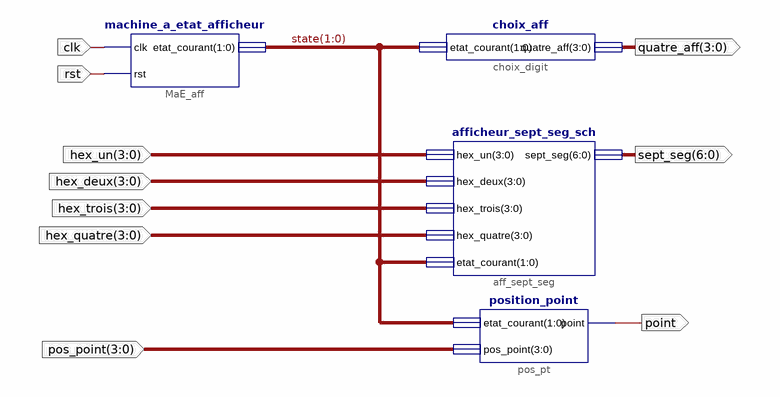
[diagram p0: schematic sheet 1]
// Xilinx ISE schematic afficheur_sch.sch (spartan3e) as structural Verilog: 4 symbols, 10 ports
module afficheur_sch (
  input  clk,
  input  rst,
  input  [3:0] hex_un,
  input  [3:0] hex_deux,
  input  [3:0] hex_trois,
  input  [3:0] hex_quatre,
  input  [3:0] pos_point,
  output [3:0] quatre_aff,
  output [6:0] sept_seg,
  output point
);

  wire [1:0] state;

  afficheur_sept_seg_sch aff_sept_seg (
    .hex_un(hex_un), .hex_deux(hex_deux), .hex_trois(hex_trois), .hex_quatre(hex_quatre),
    .etat_courant(state), .sept_seg(sept_seg));
  machine_a_etat_afficheur MaE_aff (.clk(clk), .rst(rst), .etat_courant(state));
  choix_aff choix_digit (.etat_courant(state), .quatre_aff(quatre_aff));
  position_point pos_pt (.etat_courant(state), .pos_point(pos_point), .point(point));
endmodule
